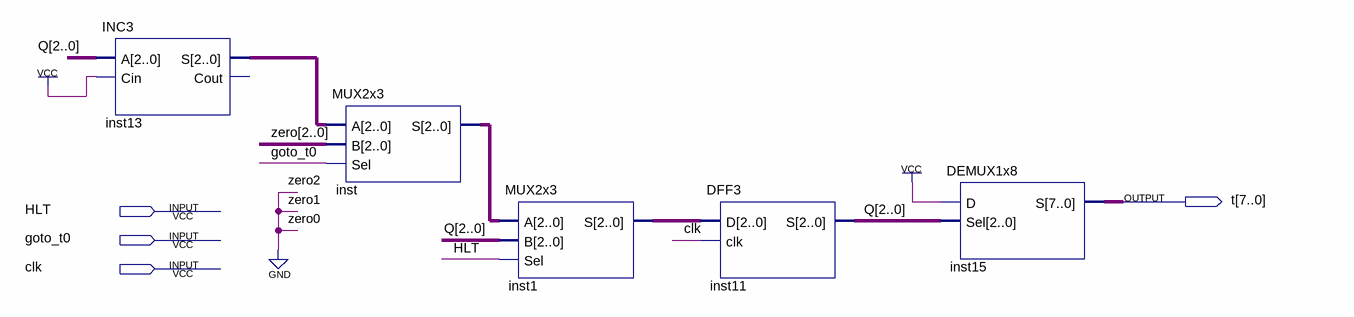
[diagram p0: schematic sheet]
// Quartus schematic Temporizador.bdf as structural Verilog: 5 symbols, 4 pins
module Temporizador (
  input  HLT,
  input  goto_t0,
  input  clk,
  output [7:0] t
);

  wire [2:0] inst1_s, inst13_s, inst_s, Q;

  INC3 inst13 (.A(Q), .Cin(1'b1), .S(inst13_s));  // open: Cout
  MUX2x3 inst (.A(inst13_s), .B(3'b000), .Sel(goto_t0), .S(inst_s));
  MUX2x3 inst1 (.A(inst_s), .B(Q), .Sel(HLT), .S(inst1_s));
  DFF3 inst11 (.D(inst1_s), .clk(clk), .S(Q));
  DEMUX1x8 inst15 (.D(1'b1), .Sel(Q), .S(t));
endmodule
